# EAGLE design OMHRS (EAGLE 5.11)
VERSION: OMHRS_3_2

## Sheet 1 of 2
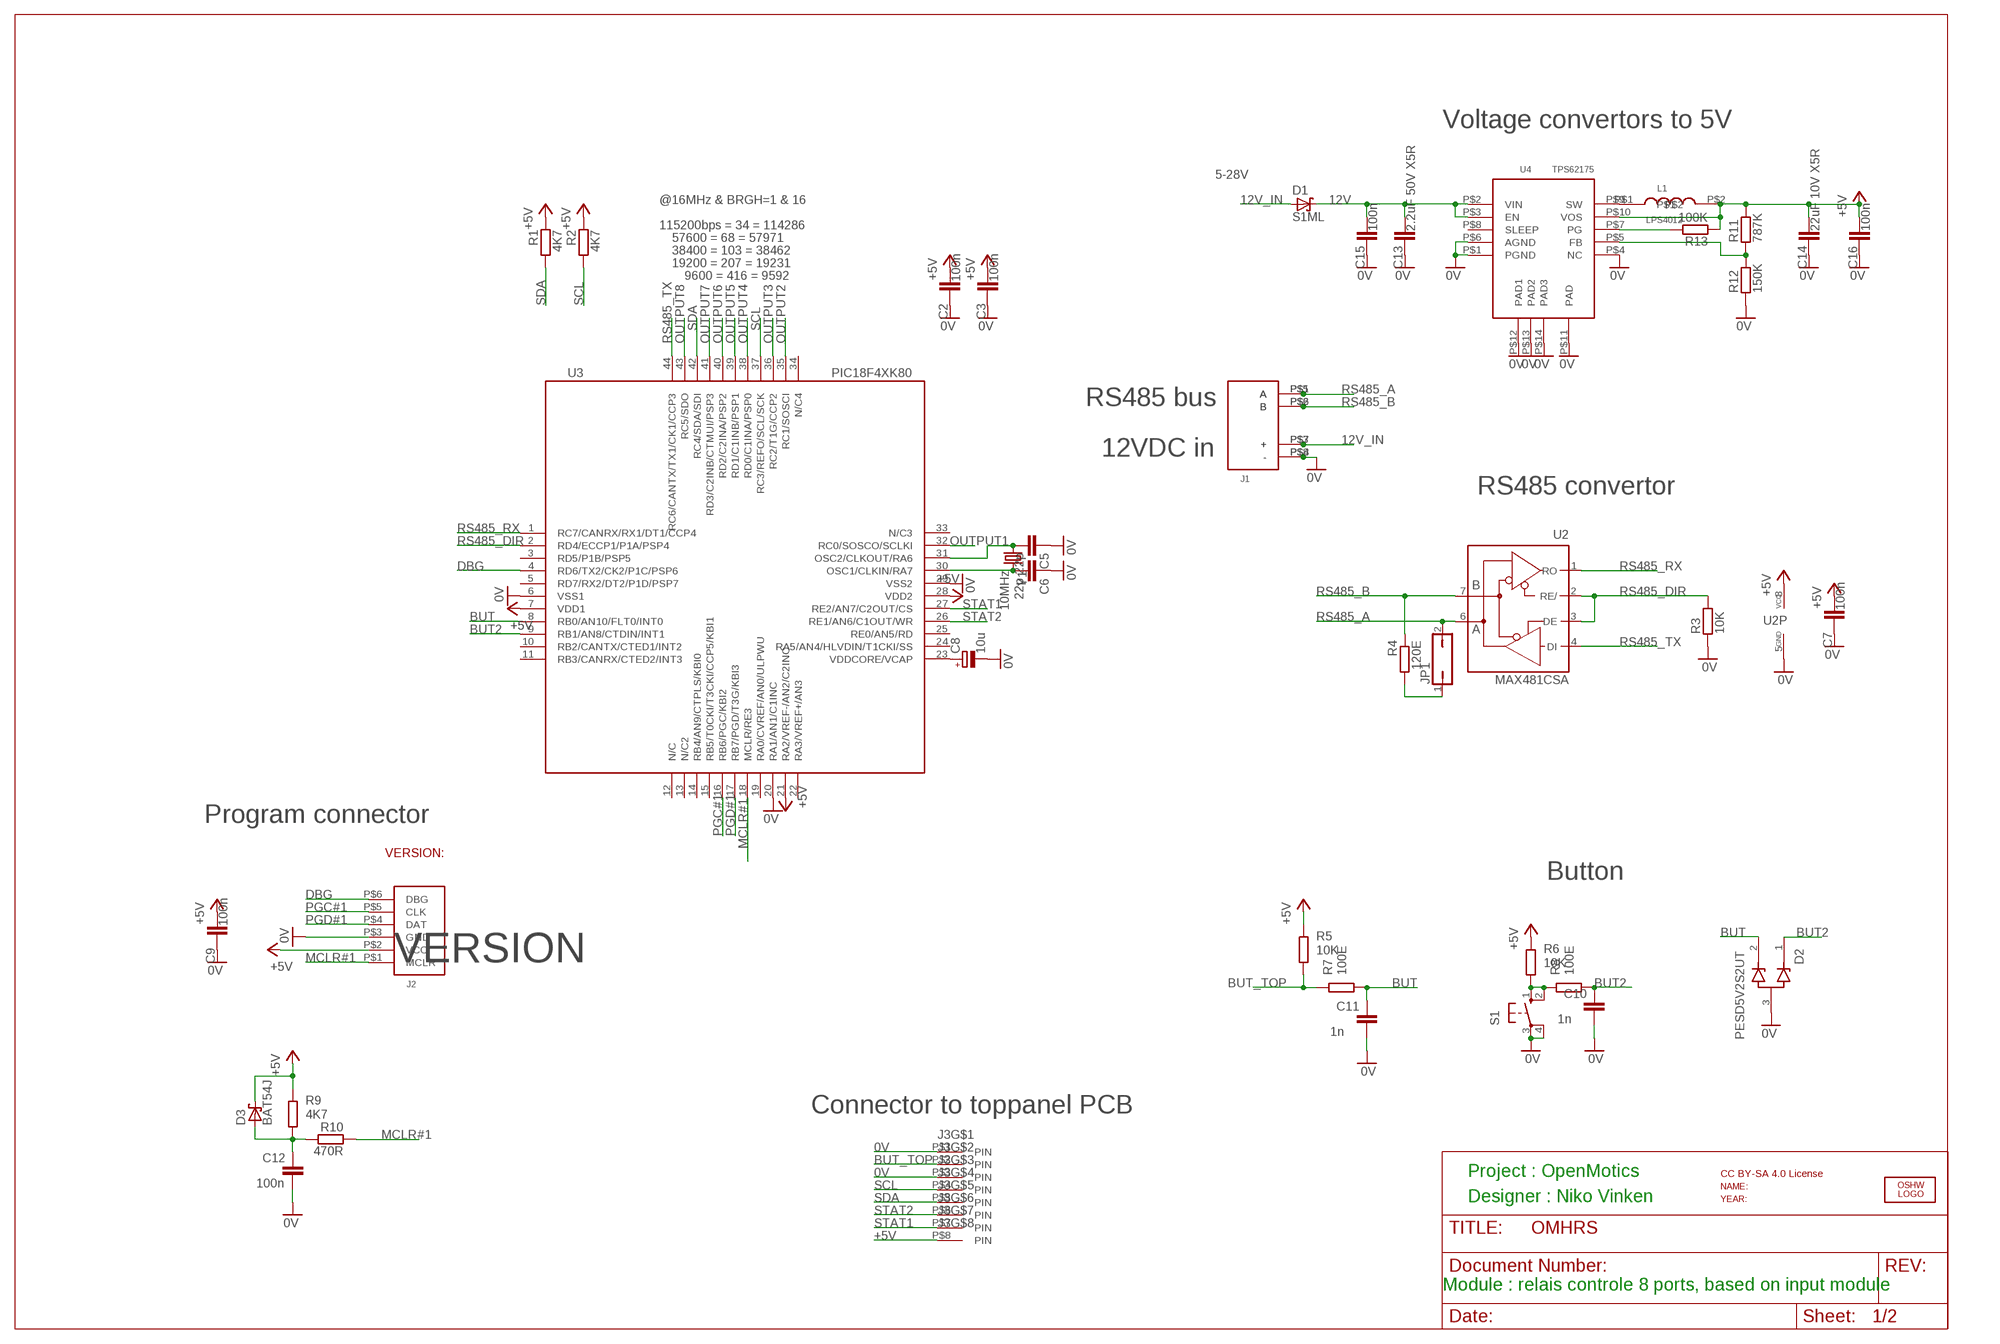
[diagram p0: schematic, sheet 1]

### Parts
C2  100n  C-EUC0603  [C0603]
C3  100n  C-EUC0603  [C0603]
C5  22p  C-EUC0603  [C0603]
C6  22p  C-EUC0603  [C0603]
C7  100n  C-EUC0603  [C0603]
C8  10u  CPOL-EUA3216-18W  [A3216-18W]
C9  100n  C-EUC0603  [C0603]
C10  1n  C-EUC0603  [C0603]
C11  1n  C-EUC0603  [C0603]
C12  100n  C-EUC0603  [C0603]
C13  2.2uF 50V X5R  C-EUC0805  [C0805]
C14  22uF 10V X5R  C-EUC0805  [C0805]
C15  100n  C-EUC0603  [C0603]
C16  100n  C-EUC0603  [C0603]
D1  S1ML  SMF5.0AT1  [SOD123FL]
D2  PESD5V2S2UT  PESD3V3S2UAT  [SOT23]
D3  BAT54J  [SOD323_REFLOW]
J1  PTDA_1.5_4-PH_5.0  [PTDA_1.5_X-PH_5.0]
J2  PROG_CON  [PROG_CON_WITH_VERSION]
J3  8PIN_CON_AMP  [8PIN_CON_AMP]
JP1  JP1Q  [JP1S]
L1  LPS4012  [LPS4012_REC]
LOGO2  OSHW_LOGO_FILLX0150-NT  [OSHW_FILLX150_NOTEXT]
R1  4K7  R-EU_R0603  [R0603]
R2  4K7  R-EU_R0603  [R0603]
R3  10K  R-EU_R0603  [R0603]
R4  120E  R-EU_R1206  [R1206]
R5  10K  R-EU_R0603  [R0603]
R6  10K  R-EU_R0603  [R0603]
R7  100E  R-EU_R0603  [R0603]
R8  100E  R-EU_R0603  [R0603]
R9  4K7  R-EU_R0603  [R0603]
R10  470R  R-EU_R0603  [R0603]
R11  787K  R-EU_R0603  [R0603]
R12  150K  R-EU_R0603  [R0603]
R13  100K  R-EU_R0603  [R0603]
S1  10-XX  [B3F-10XX]
U2  MAX481CSA  [SO08]
U3  PIC18F4XK80  [TQFP44]
U4  TPS62175  [QFN10]
U$5  CC_BY_SA  [CC_BY_SA]
Y1  10MHz  CRYSTALSM49  [SM49]

### Nets
0V: C2.2 C3.2 C5.1 C6.1 C7.2 C8.- C9.2 C10.1 C11.1 C12.1 C13.2 C14.2 C15.2 C16.2 D2.3 J1.P$4(-) J1.P$8(-) J2.P$3(GND) J3.P$1 J3.P$3 R3.1 R12.1 S1.3(P) S1.4(P1) U2.5(GND) U3.6(VSS1) U3.20(RA1/AN1/C1INC) U3.29(VSS2) U4.P$1(PGND) U4.P$4(NC) U4.P$6(AGND) U4.P$11(PAD) U4.P$12(PAD1) U4.P$13(PAD2) U4.P$14(PAD3) ; also sheet 2
12V: C13.1 C15.1 D1.C U4.P$2(VIN) U4.P$3(EN)
12V_IN: D1.A J1.P$3(+) J1.P$7(+)
+5V: C2.1 C3.1 C7.1 C9.1 C14.1 C16.1 D3.1 J2.P$2(VCC) J3.P$8 L1.P$2 R1.1 R2.1 R5.2 R6.2 R9.2 R11.2 R13.1 U2.8(VCC) U3.7(VDD1) U3.21(RA2/VREF-/AN2/C2INC) U3.28(VDD2) U4.P$10(VOS)
BUT: C11.2 D2.2 R7.1 U3.8(RB0/AN10/FLT0/INT0)
BUT1: R6.1 R8.2 S1.1(S) S1.2(S1)
BUT2: C10.2 D2.1 R8.1 U3.9(RB1/AN8/CTDIN/INT1)
BUT_TOP: J3.P$2 R5.1 R7.2
DBG: J2.P$6(DBG) U3.4(RD6/TX2/CK2/P1C/PSP6)
MCLR#1: J2.P$1(MCLR) R10.1 U3.18(MCLR/RE3)
N$1: JP1.1 R4.2
N$2: L1.P$1 U4.P$9(SW)
N$6: R11.1 R12.2 U4.P$5(FB)
N$7: R13.2 U4.P$7(PG)
N$9: C12.2 D3.2 R9.1 R10.2
N$30: C5.2 U3.31(OSC2/CLKOUT/RA6) Y1.1
N$32: C6.2 U3.30(OSC1/CLKIN/RA7) Y1.2
N$33: C8.+ U3.23(VDDCORE/VCAP)
OUTPUT1: U3.32(RC0/SOSCO/SCLKI) ; also sheet 2
OUTPUT2: U3.35(RC1/SOSCI) ; also sheet 2
OUTPUT3: U3.36(RC2/T1G/CCP2) ; also sheet 2
OUTPUT4: U3.38(RD0/C1INA/PSP0) ; also sheet 2
OUTPUT5: U3.39(RD1/C1INB/PSP1) ; also sheet 2
OUTPUT6: U3.40(RD2/C2INA/PSP2) ; also sheet 2
OUTPUT7: U3.41(RD3/C2INB/CTMUI/PSP3) ; also sheet 2
OUTPUT8: U3.43(RC5/SDO) ; also sheet 2
PGC#1: J2.P$5(CLK) U3.16(RB6/PGC/KBI2)
PGD#1: J2.P$4(DAT) U3.17(RB7/PGD/T3G/KBI3)
RS485_A: J1.P$1(A) J1.P$5(A) JP1.2 U2.6(A)
RS485_B: J1.P$2(B) J1.P$6(B) R4.1 U2.7(B)
RS485_DIR: R3.2 U2.2(RE/) U2.3(DE) U3.2(RD4/ECCP1/P1A/PSP4)
RS485_RX: U2.1(RO) U3.1(RC7/CANRX/RX1/DT1/CCP4)
RS485_TX: U2.4(DI) U3.44(RC6/CANTX/TX1/CK1/CCP3)
SCL: J3.P$4 R2.2 U3.37(RC3/REFO/SCL/SCK)
SDA: J3.P$5 R1.2 U3.42(RC4/SDA/SDI)
STAT1: J3.P$7 U3.27(RE2/AN7/C2OUT/CS)
STAT2: J3.P$6 U3.26(RE1/AN6/C1OUT/WR)
Unconnected: U3.3(RD5/P1B/PSP5) U3.5(RD7/RX2/DT2/P1D/PSP7) U3.10(RB2/CANTX/CTED1/INT2) U3.11(RB3/CANRX/CTED2/INT3) U3.12(N/C) U3.13(N/C2) U3.14(RB4/AN9/CTPLS/KBI0) U3.15(RB5/T0CKI/T3CKI/CCP5/KBI1) U3.19(RA0/CVREF/AN0/ULPWU) U3.22(RA3/VREF+/AN3) U3.24(RA5/AN4/HLVDIN/T1CKI/SS) U3.25(RE0/AN5/RD) U3.33(N/C3) U3.34(N/C4) U4.P$8(SLEEP)

### Notes on the sheet
- Voltage convertors to 5V
- 5-28V
- @16MHz & BRGH=1 & 16
- 115200bps = 34 = 114286
- 57600 = 68 = 57971
- 38400 = 103 = 38462
- 19200 = 207 = 19231
- 9600 = 416 = 9592
- RS485 bus
- 12VDC in
- RS485 convertor
- Program connector
- Button
- Connector to toppanel PCB
- Project : OpenMotics
- Designer : Niko Vinken
- Module : relais controle 8 ports, based on input module

## Sheet 2 of 2
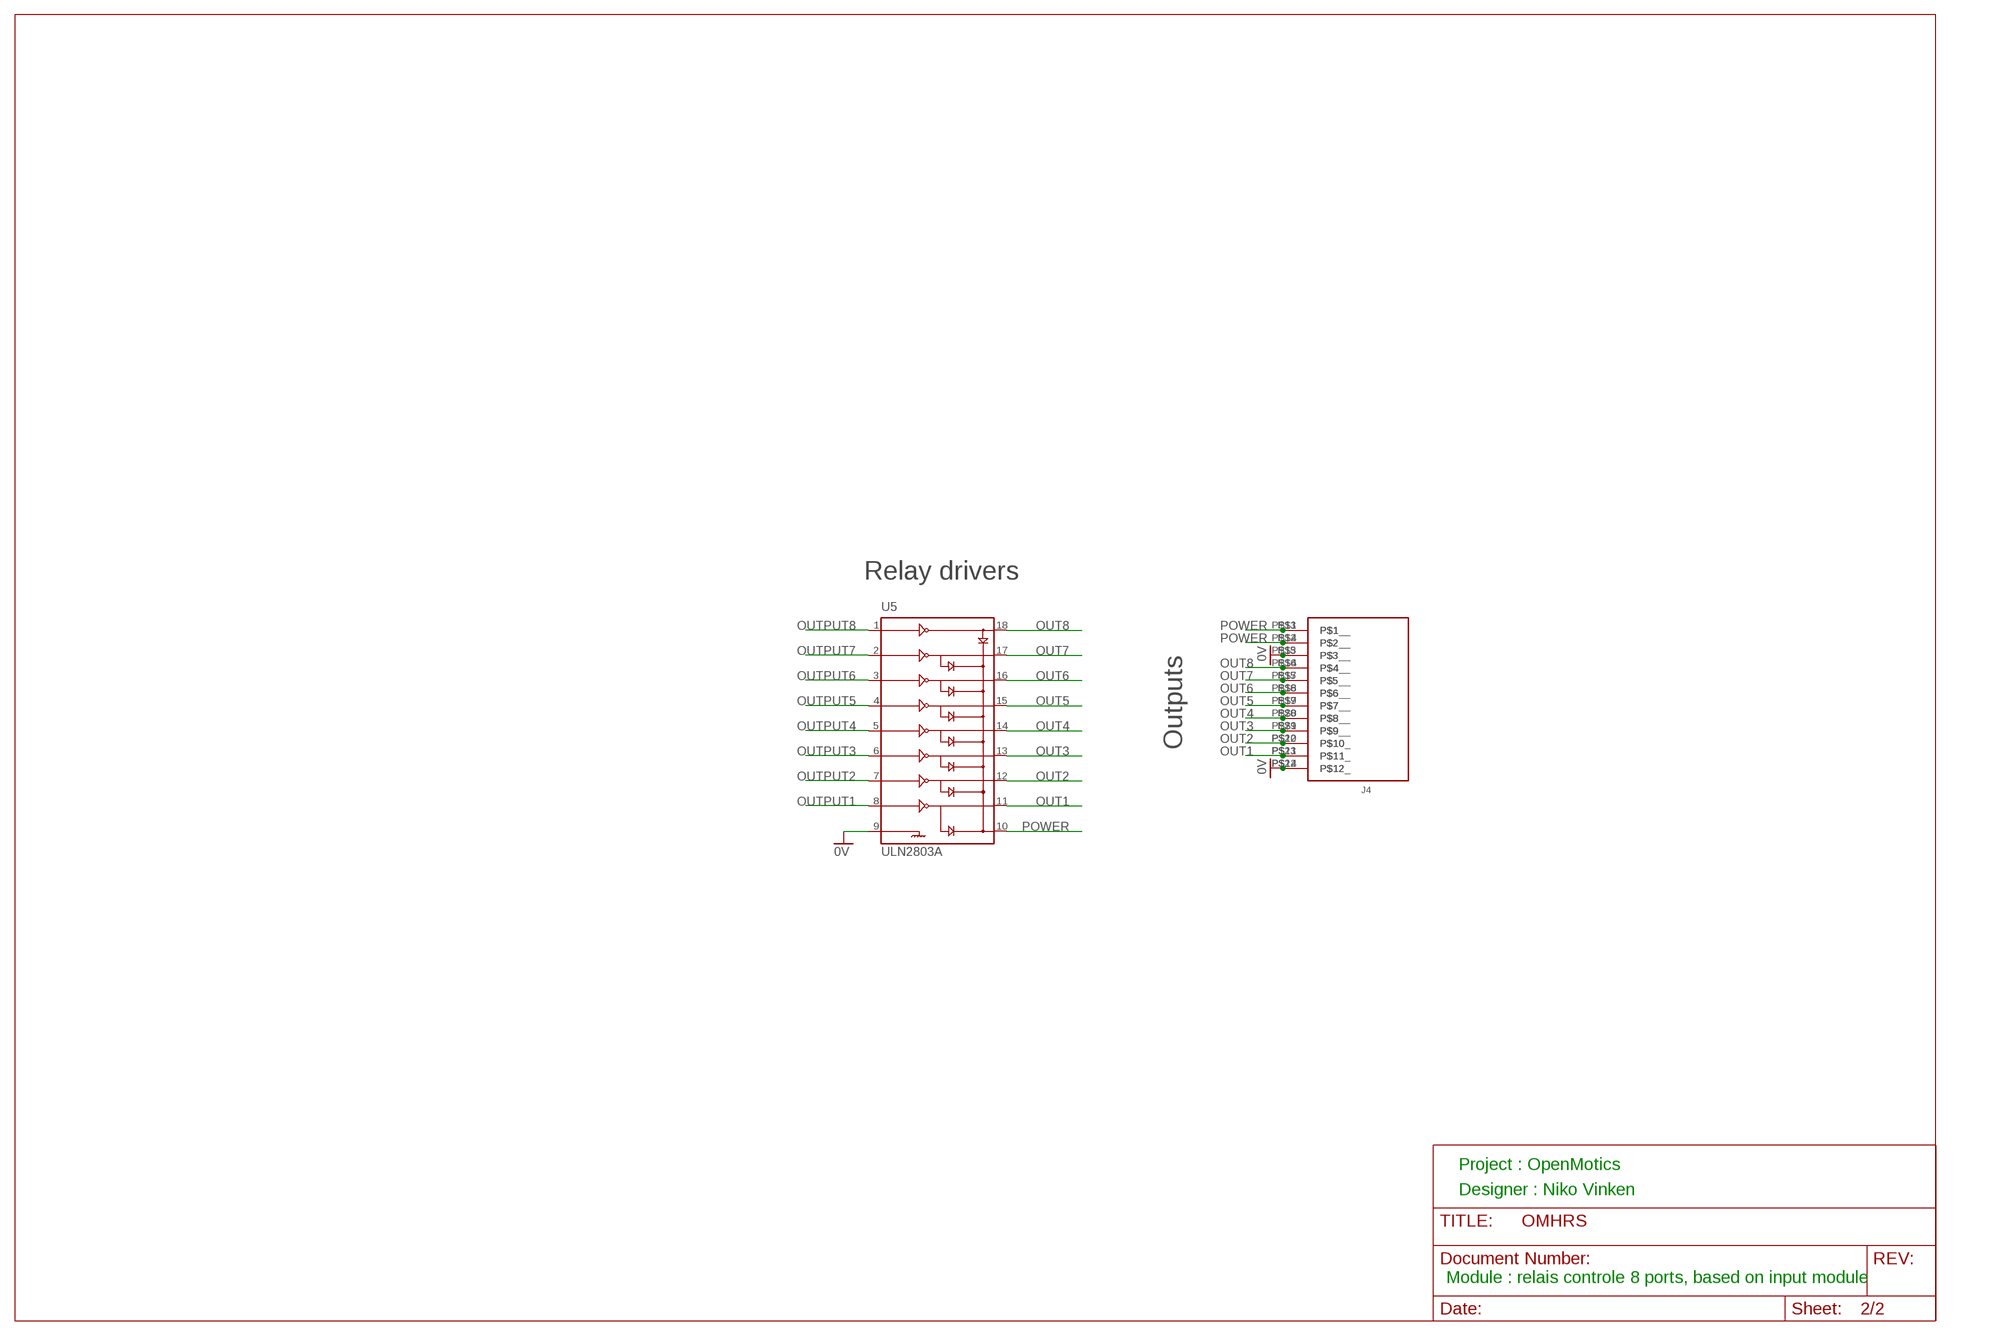
[diagram p1: schematic, sheet 2]

### Parts
J4  PTDA_1.5_12-PH_3.5  [PTDA_1.5_X-PH_3.5]
U5  ULN2803A  [SOIC18]

### Nets
0V: J4.P$3 J4.P$12 J4.P$15(P$3__) J4.P$24(P$12_) U5.9 ; also sheet 1
OUT1: J4.P$11 J4.P$23(P$11_) U5.11
OUT2: J4.P$10 J4.P$22(P$10_) U5.12
OUT3: J4.P$9 J4.P$21(P$9__) U5.13
OUT4: J4.P$8 J4.P$20(P$8__) U5.14
OUT5: J4.P$7 J4.P$19(P$7__) U5.15
OUT6: J4.P$6 J4.P$18(P$6__) U5.16
OUT7: J4.P$5 J4.P$17(P$5__) U5.17
OUT8: J4.P$4 J4.P$16(P$4__) U5.18
OUTPUT1: U5.8 ; also sheet 1
OUTPUT2: U5.7 ; also sheet 1
OUTPUT3: U5.6 ; also sheet 1
OUTPUT4: U5.5 ; also sheet 1
OUTPUT5: U5.4 ; also sheet 1
OUTPUT6: U5.3 ; also sheet 1
OUTPUT7: U5.2 ; also sheet 1
OUTPUT8: U5.1 ; also sheet 1
POWER: J4.P$1 J4.P$2 J4.P$13(P$1__) J4.P$14(P$2__) U5.10

### Notes on the sheet
- Relay drivers
- Outputs
- Project : OpenMotics
- Designer : Niko Vinken
- Module : relais controle 8 ports, based on input module

## Library data of the parts
C2 C3 C5-C7 C9-C16 = resistor:C-EU: CAPACITOR, European symbol
C8 = resistor:CPOL-EU: POLARIZED CAPACITOR, European symbol
D1 = diode:SMF5.0AT1: 200 W Transient Voltage Suppressor Source: Data sheet <http://www.onsemi.com/pub_link/Collateral/SMF5.0AT1-D.PDF>
D2 = OpenMotics:PESD3V3S2UAT
D3 = racktivity:BAT54J
J1 = OpenMotics:PTDA_1.5_4-PH_5.0
J2 = OpenMotics:PROG_CON
J3 = OpenMotics:8PIN_CON_AMP
J4 = OpenMotics:PTDA_1.5_12-PH_3.5
JP1 = jumper:JP1Q: JUMPER
L1 = OpenMotics:LPS4012
LOGO2 = ohw-logo:OSHW_LOGO_FILL
R1-R13 = resistor:R-EU_: RESISTOR, European symbol
S1 = switch-omron:10-XX: OMRON SWITCH; MPN: B3F-1000; OC_FARNELL: 176432; OC_NEWARK: 36M3542
U2 = maxim:MAX481CSA: RS485 TRANSEIVER
U3 = OpenMotics:PIC18F4XK80
U4 = OpenMotics:TPS62175
U5 = OpenMotics:ULN2803A
U$5 = OpenMotics:CC_BY_SA
Y1 = crystal:CRYSTAL: CRYSTAL

## Board
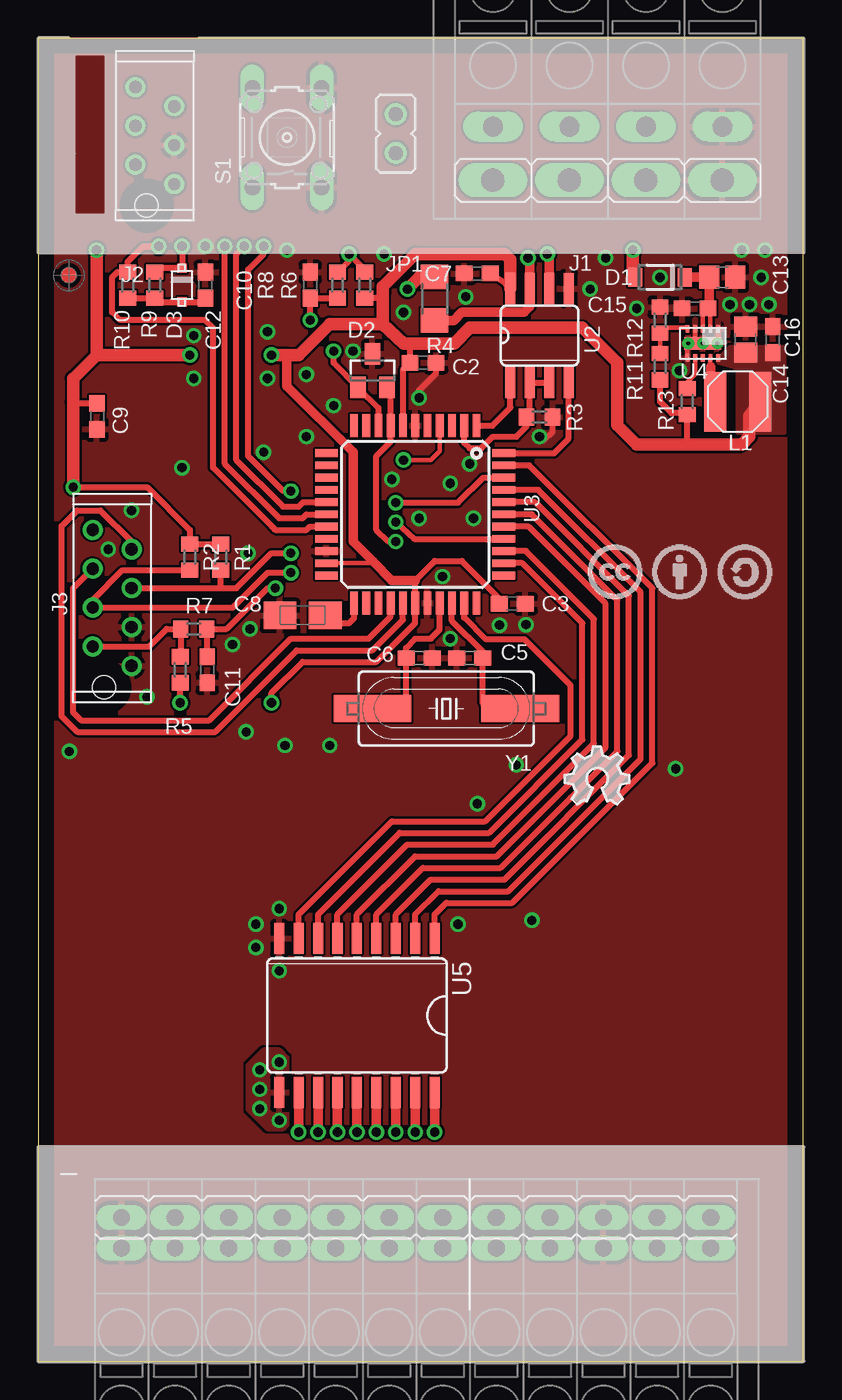
[diagram p2: board, top side]
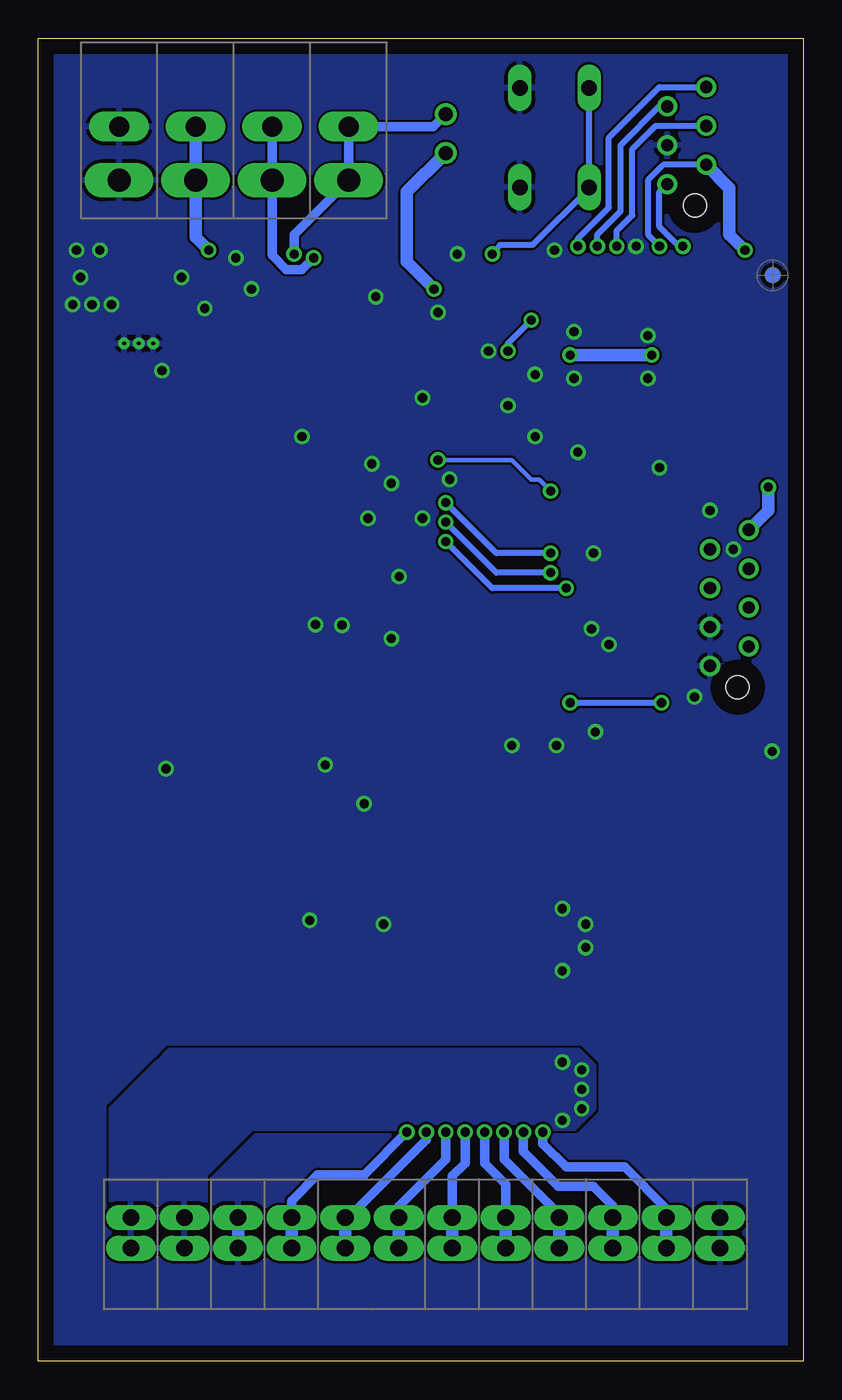
[diagram p3: board, bottom side, seen from below]

Size 50 x 86.5 mm. Coordinates in mm from the lower left corner, seen from the top.
Outline: 0,0 50,0 50,86.5 0,86.5 0,0
Copper layers (1+16): Top 0.035mm / dielectric 1.5mm / Bottom 0.035mm
Design rules "default *": minimum track width 10mil, minimum drill 24mil, track to track 6mil, track to pad 6mil, pad to pad 6mil, via to via 6mil, smd to smd 6mil, copper to edge 40mil, drill to drill 8mil, minimum pad ring 10mil, minimum via ring 8mil, stop-mask expansion 4mil, vias tented up to drill 0mil, thermal gap 10mil

### Footprints (pad centres in the part's own frame; a part is rotated, then mirrored left to right if it is on the bottom)
C0603 = smd 1.1 x 1: 1 -0.85,0; 2 0.85,0
A3216-18W = smd 2.15 x 1.8: + 1.475,0; - -1.475,0
C0805 = smd 1.3 x 1.5: 1 -0.85,0; 2 0.85,0
SOD123FL = smd 0.91 x 1.22: A 1.625,0; C -1.625,0
SOT23 = smd 1 x 1.4: 1 -0.95,-1.1; 2 0.95,-1.1; 3 0,1.1
SOD323_REFLOW = smd 0.6 x 0.6: 1 1.1,0; 2 -1.1,0
PTDA_1.5_X-PH_5.0 = drill 1.5 long: P$1 0,0; P$2 5,0; P$3 10,0; P$4 15,0 | drill 1.3 long: P$5 0,3.5; P$6 5,3.5; P$7 10,3.5; P$8 15,3.5
PROG_CON_WITH_VERSION = drill 0.8 round: P$1 0,0; P$2 -2.54,1.27; P$3 0,2.54; P$4 -2.54,3.81; P$5 0,5.08; P$6 -2.54,6.35 | hole 1.5: -1.8,-1.4
8PIN_CON_AMP = drill 0.8 round: P$1 0,0; P$2 1.27,2.54; P$3 2.54,0; P$4 3.81,2.54; P$5 5.08,0; P$6 6.35,2.54; P$7 7.62,0; P$8 8.89,2.54 | hole 1.5: -1.4,1.8
PTDA_1.5_X-PH_3.5 = drill 1.1 pad 1.422 long: P$1 0,0; P$2 3.5,0; P$3 7,0; P$4 10.5,0; P$5 14,0; P$6 17.5,0; P$7 21,0; P$8 24.5,0; P$9 28,0; P$10 31.5,0; P$11 35,0; P$12 38.5,0; P$13 0,2; P$14 3.5,2; P$15 7,2; P$16 10.5,2; P$17 14,2; P$18 17.5,2; P$19 21,2; P$20 24.5,2; P$21 28,2; P$22 31.5,2; P$23 35,2; P$24 38.5,2
JP1S = drill 0.914 round: 1 1.27,1.27; 2 1.27,3.81
LPS4012_REC = smd 1.45 x 3.89: P$1 -1.475,0; P$2 1.475,0
R0603 = smd 1 x 1.1: 1 -0.85,0; 2 0.85,0
R1206 = smd 1.6 x 1.803: 1 -1.422,0; 2 1.422,0
B3F-10XX = drill 1.016 long: 1 -3.251,2.261; 2 3.251,2.261; 3 -3.251,-2.261; 4 3.251,-2.261
SO08 = smd 0.66 x 2.032: 1 -1.905,-3.073; 2 -0.635,-3.073; 3 0.635,-3.073; 4 1.905,-3.073; 5 1.905,3.073; 6 0.635,3.073; 7 -0.635,3.073; 8 -1.905,3.073
TQFP44 = smd 1.5 x 0.5: 1 -5.8,4; 2 -5.8,3.2; 3 -5.8,2.4; 4 -5.8,1.6; 5 -5.8,0.8; 6 -5.8,0; 7 -5.8,-0.8; 8 -5.8,-1.6; 9 -5.8,-2.4; 10 -5.8,-3.2; 11 -5.8,-4; 23 5.8,-4; 24 5.8,-3.2; 25 5.8,-2.4; 26 5.8,-1.6; 27 5.8,-0.8; 28 5.8,0; 29 5.8,0.8; 30 5.8,1.6; 31 5.8,2.4; 32 5.8,3.2; 33 5.8,4 | smd 0.5 x 1.5: 12 -4,-5.8; 13 -3.2,-5.8; 14 -2.4,-5.8; 15 -1.6,-5.8; 16 -0.8,-5.8; 17 0,-5.8; 18 0.8,-5.8; 19 1.6,-5.8; 20 2.4,-5.8; 21 3.2,-5.8; 22 4,-5.8; 34 4,5.8; 35 3.2,5.8; 36 2.4,5.8; 37 1.6,5.8; 38 0.8,5.8; 39 0,5.8; 40 -0.8,5.8; 41 -1.6,5.8; 42 -2.4,5.8; 43 -3.2,5.8; 44 -4,5.8
QFN10 = smd 0.5 x 0.25: P$1 -0.95,1; P$2 -0.95,0.5; P$3 -0.95,0; P$4 -0.95,-0.5; P$5 -0.95,-1; P$6 0.95,-1; P$7 0.95,-0.5; P$8 0.95,0; P$9 0.95,0.5; P$10 0.95,1 | smd 0.84 x 2.4: P$11 0,0 | drill 0.25 round: P$12 0,0.95; P$13 0,0; P$14 0,-0.95
SOIC18 = smd 0.66 x 2.032: 1 1.27,0.051; 2 2.54,0.051; 3 3.81,0.051; 4 5.08,0.051; 5 6.35,0.051; 6 7.62,0.051; 7 8.89,0.051; 8 10.16,0.051; 9 11.43,0.051; 10 11.43,10.109; 11 10.16,10.109; 12 8.89,10.109; 13 7.62,10.109; 14 6.35,10.109; 15 5.08,10.109; 16 3.81,10.109; 17 2.54,10.109; 18 1.27,10.109
SM49 = smd 5.08 x 1.778: 1 -4.826,0; 2 4.826,0

### Placement (x,y rotation side)
C2  25.15,65.28 0 top
C3  30.99,49.53 0 top
C5  28.19,45.97 0 top
C6  24.89,45.97 180 top
C7  28.7,71.12 180 top
C8  17.27,48.77 0 top
C9  3.83,61.78 270 top
C10  17.78,70.36 270 top
C11  11.05,45.21 90 top
C12  10.92,70.36 270 top
C13  44.7,70.87 0 top
C14  46.23,66.8 90 top
C15  42.93,68.83 180 top
C16  48.01,66.8 90 top
D1  40.64,70.87 180 top
D2  21.84,64.77 0 top
D3  9.4,70.36 90 top
J1  29.72,77.22 0 top
J2  8.89,76.96 0 top
J3  6.1,45.47 90 top
J4  43.94,9.4 180 top
JP1  22.1,77.72 0 top
L1  45.72,62.74 0 top
LOGO2  34.4,36.4 0 top
R1  11.94,52.58 270 top
R2  9.91,52.58 270 top
R3  32.77,61.72 180 top
R4  25.91,69.47 90 top
R5  9.27,45.21 270 top
R6  21.34,70.36 270 top
R7  10.16,47.88 180 top
R8  19.56,70.36 90 top
R9  7.62,70.36 90 top
R10  5.84,70.36 270 top
R11  40.64,65.02 270 top
R12  40.64,68.07 270 top
R13  42.42,62.74 90 top
S1  16.26,80.01 90 top
U2  32.77,67.06 0 top
U3  24.64,55.37 270 top
U4  43.43,66.55 270 top
U5  27.18,27.69 180 top
U$2  [FIDUCIAL_G10]  2,71 0 top
U$4  CNMB/3  [CNMB/3-]  -1.5,-1.75 0 top
U$5  41.9,51.6 0 top
U$12  [FIDUCIAL_G10]  2,71 0 bottom
Y1  26.67,42.67 180 top

### Tracks (layer width: path | path; a pad name or v marks a point on that pad's centre or on a via)
0V  (via drill 0.6)
  Top 0.305: U4.P$4 42.93,66.55 U4.P$14 | 44.45,66.55 44.45,67.56 | 42.42,65.53 42.42,66.55
  Top 0.406: R3.1 33.62,60.79 33.02,60.2 | v24.89,62.99 24.89,63.5 26,64.6 C2.2
  Bottom 0.813: J4.P$15 J4.P$3
  other vias: 16.26,72.64 23.88,68.58 27.94,69.6 31.87,48.16 28.19,58.67 26.42,51.31 26.92,47.24 19.05,40.26 13.84,47.88 16.13,40.26 30.14,48.13 26.92,57.4 24.89,55.12 28.45,55.12 20.57,66.04 14.99,64.26 14.73,59.44 9.4,58.42 6.1,55.63 13.72,52.83 2.03,39.88 10.16,64.26 17.53,60.45 4.57,53.09 7.11,43.43 32.77,60.45 17.53,64.52 19.3,62.48 22.61,72.39 37.08,72.14 12.7,46.86 13.59,41.15 23.11,57.66 45.97,72.64 47.5,72.64 14.99,67.31 10.16,67.06 10.92,72.9 36.07,70.1 15.75,29.59 14.22,28.57 14.22,27.05 15.75,25.53 28.7,36.45 31.24,38.99 27.43,28.57 41.66,38.73 32.26,28.83 47.75,69.09 46.48,69.09 45.21,69.09 39.12,68.83 40.64,70.87 47.24,70.87 41.91,64.77
  pour Bottom (rank 3): 0.25,86.36 49.78,86.36 49.78,0.25 0.25,0.25
  pour Top (rank 2): 14.22,86.36 49.78,86.36 49.78,0.25 0.25,0.25 0.25,86.42 14.22,86.42
12V
  Top 0.305: U4.P$2 43.93,68.68 C15.1 43.43,68.49 U4.P$3
  Top 0.61: D1.C C13.1 43.85,68.91 C15.1
12V_IN  (via drill 0.6)
  Top 0.813: v38.86,72.64 38.86,71.22 D1.A
  Bottom 0.813: J1.P$7 J1.P$3 39.72,73.5 v38.86,72.64
+5V  (via drill 0.6)
  Top 0.305: U3.21 21.88,52.17 21.88,52.28
  Top 0.406: C7.1 30.54,70.45 U2.8 | R6.2 22.18,69.51 22.52,69.85 | C3.1 30.14,49.87 27.69,52.32 25.91,52.32 24.64,51.05 U3.28 24.64,48.26 22.1,45.72 17.27,45.72 15.24,43.69 v15.24,43.05 | U3.7 23.84,64.82 C2.1 24.3,66.38 23.88,66.55 | v9.27,43.05 R5.2 | R1.1 R2.1 9.91,54.36 7.11,57.15 v2.29,57.15 | v9.4,72.9 D3.1 7.87,71.46 R9.2 | 42.42,59.94 R13.1 42.33,61.98 41.4,61.98 40.64,62.74 R11.2 | C9.1 2.39,62.63 2.29,62.74
  Top 0.61: 24.64,51.05 23.11,51.05 21.88,52.28 20.57,53.59 20.57,59.44 16.26,63.75 16.26,65.79
  Top 0.813: U2.8 30.86,72.01 30.48,72.39 24.64,72.39 22.52,70.27 22.52,69.85 22.52,67.82 | 22.52,67.82 19.05,67.82 17.02,65.79 16.26,65.79 v15.24,65.79 | 22.52,67.82 23.88,66.55 27.18,66.55 28.19,67.56 35.56,67.56 37.85,65.28 37.85,61.21 39.12,59.94 42.42,59.94 45.97,59.94 46.48,60.45 46.48,61.8 L1.P$2 | v2.29,57.15 2.29,62.74 2.29,64.26 3.81,65.79 | v9.91,65.79 3.81,65.79 | 3.81,65.79 v3.81,72.64
  Bottom 0.406: v9.27,43.05 v15.24,43.05 | v9.4,72.9 10.16,73.66 10.16,77.22 9.14,78.23 J2.P$2
  Bottom 0.813: v15.24,65.79 v9.91,65.79 | v2.29,57.15 2.29,55.63 J3.P$8 | J2.P$2 4.83,76.71 4.83,73.66 v3.81,72.64
  pour Top (no thermals): 44.45,65.28 44.45,65.53 45.21,66.29 48.77,66.29 48.77,60.71 45.72,60.71 45.72,64.77 45.47,65.02
BUT  (via drill 0.6)
  Top 0.406: v23.37,53.59 22.86,53.59 22.1,54.36 22.1,59.18 23.04,60.12 U3.8 | U3.8 23.11,61.1 | v15.49,50.55 14.99,50.55 12.32,47.88 R7.1 11.05,47.84 C11.2 | U3.8 23.04,63.43 D2.2
  Bottom 0.406: v15.49,50.55 20.32,50.55 v23.37,53.59
BUT1  (via drill 0.6)
  Top 0.406: R6.1 21.34,71.37 v20.32,72.39 20.32,71.97 R8.2
  Bottom 0.406: S1.2 S1.1 13.97,76.71 17.7,72.97 19.81,72.97 v20.32,72.39
BUT2  (via drill 0.6)
  Top 0.406: R8.1 C10.2 17.78,68.33 arc90 v17.78,68.07 | U3.9 22.24,62.33 D2.1 19.3,65.26 v19.3,66.04
  Bottom 0.406: v19.3,66.04 19.3,66.55 19.05,66.8 v17.78,68.07
BUT_TOP
  Top 0.406: R5.1 9.31,46.1 R7.2 8.38,47.88 7.24,46.74 J3.P$2
DBG  (via drill 0.6)
  Top 0.305: U3.4 26.24,59.51 25.65,58.93 v23.88,58.93
  Top 0.406: v16.51,56.9 16,56.9 13.72,59.18 13.72,71.37 14.73,72.39 v14.73,72.9
  Bottom 0.305: v23.88,58.93 19.05,58.93 17.78,57.66 17.27,57.66 v16.51,56.9
  Bottom 0.406: J2.P$6 9.4,83.31 12.7,80.01 12.7,75.44 14.48,73.66 14.73,73.41 v14.73,72.9
MCLR#1  (via drill 0.6)
  Top 0.406: U3.18 17.74,54.57 17.53,54.36 15.49,54.36 15.28,54.57 11.43,58.42 11.43,67.56 10.92,68.07 5.33,68.07 4.83,68.58 4.83,70.87 5.17,71.21 R10.1 5.84,71.88 6.86,72.9 v7.87,72.9
  Bottom 0.406: v7.87,72.9 8.13,72.9 9.4,74.17 9.4,76.45 J2.P$1
N$1  (via drill 0.6)
  Top 0.813: R4.2 24.92,70.89 v24.13,70.1
  Bottom 0.813: v24.13,70.1 25.91,71.88 25.91,76.45 JP1.1
N$2
  Top 0.305: U4.P$9 43.93,65.03 43.94,65.02
  Top 0.61: 43.94,65.02 43.94,62.82 L1.P$1
N$6
  Top 0.305: U4.P$5 42.43,67.56 40.98,67.56 arc90 R12.2 R11.1
N$7
  Top 0.305: U4.P$7 42.93,64.52 42.42,64.01 R13.2
N$9
  Top 0.406: R10.2 R9.1 7.87,69.26 D3.2 10.67,69.26 C12.2
N$30
  Top 0.406: U3.31 27.04,48.4 29.04,46.39 C5.2 29.04,43.09 29.21,42.67 Y1.1
N$32
  Top 0.406: Y1.2 24.04,42.84 C6.2 24.04,46.65 24.64,47.24 25.65,47.24 26.24,47.83 U3.30
N$33
  Top 0.406: C8.+ 19.25,48.26 20.32,48.26 20.64,48.58 U3.23
OUT1  (via drill 0.6)
  Top 0.61: v17.02,14.99 U5.11
  Bottom 0.61: J4.P$11 8.94,9.96 11.68,12.7 15.49,12.7 17.02,14.22 v17.02,14.99
  Bottom 0.813: J4.P$23 J4.P$11
OUT2  (via drill 0.6)
  Top 0.61: v18.29,14.99 U5.12
  Bottom 0.61: J4.P$10 12.44,10.16 13.72,11.43 16,11.43 18.29,13.72 v18.29,14.99
  Bottom 0.813: J4.P$22 J4.P$10
OUT3  (via drill 0.6)
  Top 0.61: v19.56,14.99 U5.13
  Bottom 0.61: J4.P$9 15.94,9.59 19.56,13.21 v19.56,14.99
  Bottom 0.813: J4.P$21 J4.P$9
OUT4  (via drill 0.6)
  Top 0.61: v20.83,14.99 U5.14
  Bottom 0.61: J4.P$8 19.44,11.57 20.83,12.95 v20.83,14.99
  Bottom 0.813: J4.P$20 J4.P$8
OUT5  (via drill 0.6)
  Top 0.61: v22.1,14.99 U5.15
  Bottom 0.61: J4.P$7 22.94,12.11 22.1,12.95 v22.1,14.99
  Bottom 0.813: J4.P$19 J4.P$7
OUT6  (via drill 0.6)
  Top 0.61: v23.37,14.99 U5.16
  Bottom 0.61: J4.P$6 26.44,10.13 23.37,13.21 v23.37,14.99
  Bottom 0.813: J4.P$18 J4.P$6
OUT7  (via drill 0.6)
  Top 0.61: v24.64,14.99 U5.17
  Bottom 0.61: J4.P$5 29.72,9.4 24.64,14.48 v24.64,14.99
  Bottom 0.813: J4.P$17 J4.P$5
OUT8  (via drill 0.6)
  Top 0.61: v25.91,14.99 U5.18
  Bottom 0.61: J4.P$4 33.44,10.5 31.75,12.19 28.7,12.19 v25.91,14.99
  Bottom 0.813: J4.P$16 J4.P$4
OUTPUT1
  Top 0.406: U3.32 27.84,48.62 29.26,47.2 31.8,47.2 34.8,44.2 34.8,40.89 29.21,35.31 23.11,35.31 17.02,29.21 U5.8
OUTPUT2
  Top 0.406: U3.35 31.65,52.17 35.56,48.26 35.56,40.64 29.46,34.54 23.62,34.54 18.29,29.21 U5.7
OUTPUT3
  Top 0.406: U3.36 31.86,52.97 36.32,48.51 36.32,40.39 29.72,33.78 24.13,33.78 19.56,29.21 U5.6
OUTPUT4
  Top 0.406: U3.38 32.04,54.57 37.08,49.53 37.08,40.13 29.97,33.02 24.64,33.02 20.83,29.21 U5.5
OUTPUT5
  Top 0.406: U3.39 32.26,55.37 37.85,49.78 37.85,39.88 34.8,36.83 34.04,36.07 30.23,32.26 25.15,32.26 22.1,29.21 U5.4
OUTPUT6
  Top 0.406: U3.40 32.47,56.17 38.61,50.04 38.61,39.62 30.48,31.5 25.65,31.5 23.37,29.21 U5.3
OUTPUT7
  Top 0.406: U3.41 32.69,56.97 39.37,50.29 39.37,39.37 30.73,30.73 26.16,30.73 24.64,29.21 U5.2
OUTPUT8
  Top 0.406: U3.43 32.11,58.57 40.13,50.55 40.13,39.12 30.99,29.97 26.67,29.97 25.91,29.21 U5.1
PGC#1  (via drill 0.6)
  Top 0.406: U3.16 17.31,56.17 17.02,55.88 16,55.88 12.95,58.93 12.95,72.39 v13.46,72.9
  Bottom 0.406: J2.P$5 9.4,82.04 11.94,79.5 11.94,75.18 13.46,73.66 v13.46,72.9
PGD#1  (via drill 0.6)
  Top 0.406: U3.17 17.53,55.37 17.27,55.12 15.75,55.12 12.19,58.67 v12.19,72.9
  Bottom 0.406: J2.P$4 9.65,80.77 11.18,79.25 11.18,74.93 12.19,73.91 v12.19,72.9
POWER  (via drill 0.6)
  other vias: 15.75,19.56 14.48,19.05 14.48,17.78 14.48,16.51 15.75,15.75
  pour Bottom (rank 2): 14.73,20.32 13.72,19.3 13.72,16.51 14.99,15.24 36.07,15.24 39.12,12.19 39.12,7.11 39.37,6.86 44.96,6.86 45.21,7.11 45.21,16.51 42.16,19.56 41.4,20.32
  pour Top: 16.26,15.49 16.26,19.81 15.75,20.32 14.73,20.32 13.72,19.3 13.72,16.51 14.99,15.24 16,15.24
RS485_A  (via drill 0.6)
  Top 0.61: U2.6 33.4,72.26 v33.27,72.39
  Bottom 0.61: v33.27,72.39 33.27,73.66 J1.P$1 J1.P$5 24.19,80.72 JP1.2
RS485_B  (via drill 0.6)
  Top 0.61: v32,72.14 32.13,71.75 U2.7 32.13,68.96 31.75,68.58 27.69,68.58 27.15,68.05 R4.1
  Bottom 0.61: J1.P$6 J1.P$2 34.72,72.31 33.78,71.37 32.77,71.37 v32,72.14
RS485_DIR
  Top 0.406: U3.2 27.84,60.05 28.19,59.69 28.96,59.69 29.72,60.45 31.24,60.45 31.92,61.13 R3.2 arc90 32.13,61.94 U2.2 U2.3
RS485_RX
  Top 0.406: U3.1 29.68,61.17 30.86,62.36 U2.1
RS485_TX
  Top 0.406: U3.44 33.72,59.37 34.67,60.33 U2.4
SCL  (via drill 0.6)
  Top 0.406: U3.37 24.56,53.77 v23.37,54.86 | v16.51,51.56 14.99,51.56 12.7,49.28 J3.P$4 3.56,49.78 5.5,51.73 R2.2
  Bottom 0.406: v23.37,54.86 20.07,51.56 v16.51,51.56
SDA  (via drill 0.6)
  Top 0.406: v23.37,56.13 27.43,56.13 29.07,57.77 U3.42 | v16.51,52.83 15.24,52.83 12.95,50.55 11.94,50.55 | J3.P$5 11.94,50.55 | 11.94,50.55 R1.2
  Bottom 0.406: v16.51,52.83 20.07,52.83 v23.37,56.13
STAT1
  Top 0.406: U3.27 23.84,48.48 21.84,46.48 16.89,46.48 11.56,41.15 2.54,41.15 1.52,42.16 1.52,54.61 2.54,55.63 4.06,55.63 6.1,53.59 J3.P$7
STAT2
  Top 0.406: U3.26 23.04,48.69 21.59,47.24 16.51,47.24 11.18,41.91 2.79,41.91 2.29,42.42 2.29,50.55 J3.P$6